# EAGLE design breakout_MDBT40 (EAGLE 7.4.0)
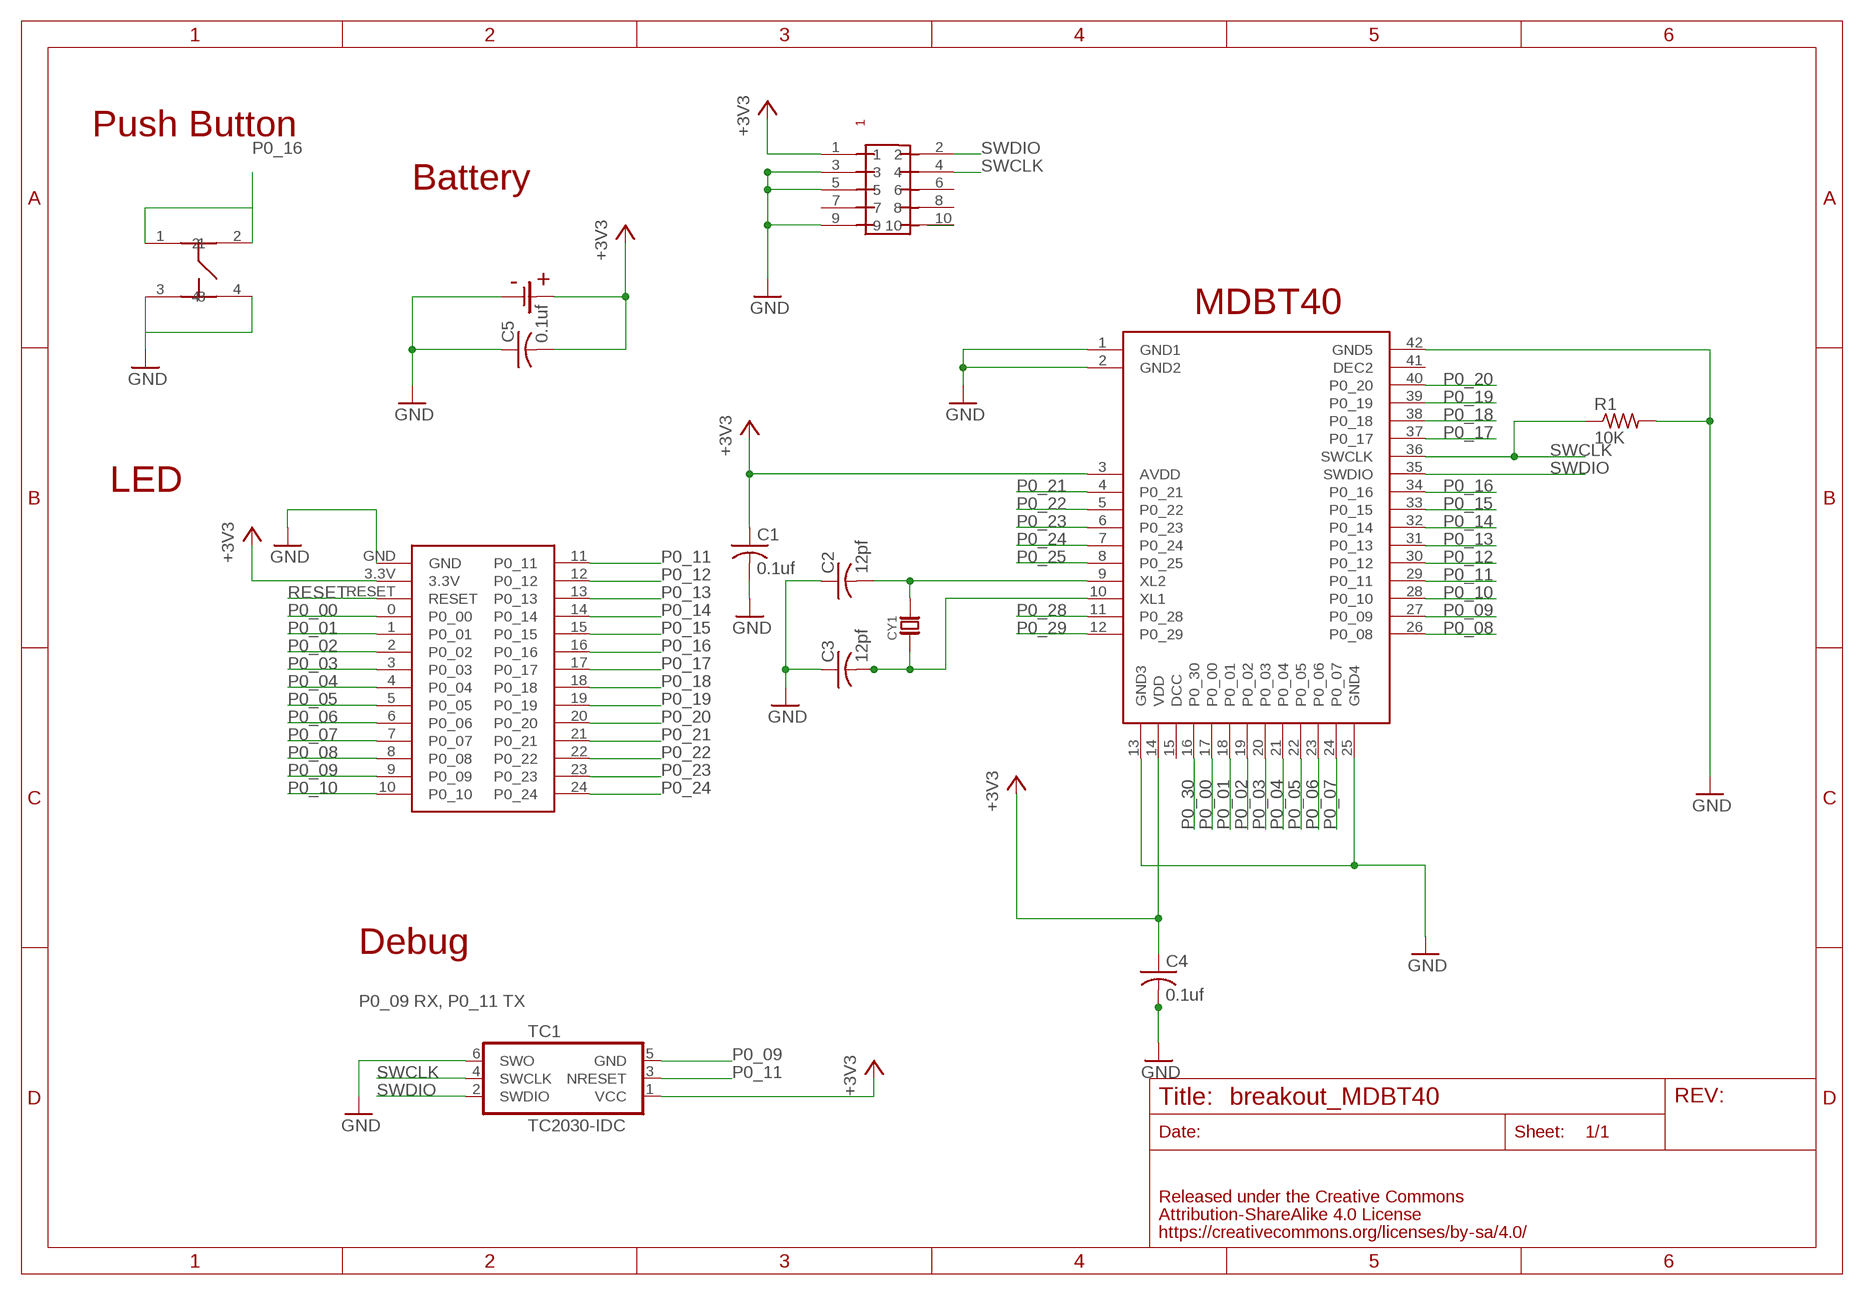
[diagram p0: schematic, sheet 1]

## Parts
C1  0.1uf  C-USC0603  [C0603]
C2  12pf  C-USC0603  [C0603]
C3  12pf  C-USC0603  [C0603]
C4  0.1uf  C-USC0603  [C0603]
C5  0.1uf  C-USC0603  [C0603]
CY1  CRYSTALABS07  [ABRACOM-ABS07-32.768KHZ]
R1  10K  R-US_R0603  [R0603]
TC1  TC2030-IDC  [TC2030-IDC]
U$1  RAYTAC-MDBT40  [RAYTAC-MDBT40]
U$3  BLE-BREAKOUT-NORDIC  [BLE-BREAKOUT-NORDIC]
U$4  PIN-HEADER-SMT(1.27MM)2X5  [PIN-HEADER-SMT(1.27MM)2X5]
U$5  SWICTH-4P(KMR2)  [SWITCH-4P(KMR2)]
U$8  SMTU-TOP2032  [SMTU-2032]

## Nets
+3V3: C1.1 C4.1 C5.2 TC1.1(VCC) U$1.3(AVDD) U$1.14(VDD) U$3.3.3V U$4.1 U$8.+
GND: C1.2 C2.1 C3.1 C4.2 C5.1 R1.2 TC1.6(SWO) U$1.1(GND1) U$1.2(GND2) U$1.13(GND3) U$1.25(GND4) U$1.42(GND5) U$3.GND U$4.3 U$4.5 U$4.9 U$5.3 U$5.4 U$8.-
N$7: C2.2 CY1.P$2 U$1.9(XL2)
N$8: C3.2 CY1.P$1 U$1.10(XL1)
P0_00: U$1.17(P0_00) U$3.0(P0_00)
P0_01: U$1.18(P0_01) U$3.1(P0_01)
P0_02: U$1.19(P0_02) U$3.2(P0_02)
P0_03: U$1.20(P0_03) U$3.3(P0_03)
P0_04: U$1.21(P0_04) U$3.4(P0_04)
P0_05: U$1.22(P0_05) U$3.5(P0_05)
P0_06: U$1.23(P0_06) U$3.6(P0_06)
P0_07: U$1.24(P0_07) U$3.7(P0_07)
P0_08: U$1.26(P0_08) U$3.8(P0_08)
P0_09: TC1.5(GND) U$1.27(P0_09) U$3.9(P0_09)
P0_10: U$1.28(P0_10) U$3.10(P0_10)
P0_11: TC1.3(NRESET) U$1.29(P0_11) U$3.11(P0_11)
P0_12: U$1.30(P0_12) U$3.12(P0_12)
P0_13: U$1.31(P0_13) U$3.13(P0_13)
P0_14: U$1.32(P0_14) U$3.14(P0_14)
P0_15: U$1.33(P0_15) U$3.15(P0_15)
P0_16: U$1.34(P0_16) U$3.16(P0_16) U$5.1 U$5.2
P0_17: U$1.37(P0_17) U$3.17(P0_17)
P0_18: U$1.38(P0_18) U$3.18(P0_18)
P0_19: U$1.39(P0_19) U$3.19(P0_19)
P0_20: U$1.40(P0_20) U$3.20(P0_20)
P0_21: U$1.4(P0_21) U$3.21(P0_21)
P0_22: U$1.5(P0_22) U$3.22(P0_22)
P0_23: U$1.6(P0_23) U$3.23(P0_23)
P0_24: U$1.7(P0_24) U$3.24(P0_24)
P0_25: U$1.8(P0_25)
P0_28: U$1.11(P0_28)
P0_29: U$1.12(P0_29)
P0_30: U$1.16(P0_30)
RESET: U$3.RESET
RESET1: U$4.10
SWCLK: R1.1 TC1.4(SWCLK) U$1.36(SWCLK) U$4.4
SWDIO: TC1.2(SWDIO) U$1.35(SWDIO) U$4.2
Unconnected: U$1.15(DCC) U$1.41(DEC2) U$4.6 U$4.7 U$4.8

## Notes on the sheet
- Push Button
- Battery
- MDBT40
- LED
- Debug
- P0_09 RX, P0_11 TX

## Library data of the parts
C1-C5 = adafruit:C-US: CAPACITOR, American symbol
CY1 = FaBo-Crystal:CRYSTAL
R1 = adafruit:R-US_: RESISTOR, American symbol
TC1 = TagConnect:TC2030-IDC: Tag-Connect In Circuit Programming & Debug Cable 6 Pin http://www.tag-connect.com
U$1 = gclueBT:RAYTAC-MDBT40
U$3 = FaBo-Template:BLE-BREAKOUT-NORDIC
U$4 = gclue:PIN-HEADER-SMT(1.27MM)2X5: PIN-HEADER-SMT (1.27MM) 2x5
U$5 = gclue-test:SWICTH-4P(KMR2)
U$8 = FaBo-Supply:SMTU-TOP

## Board
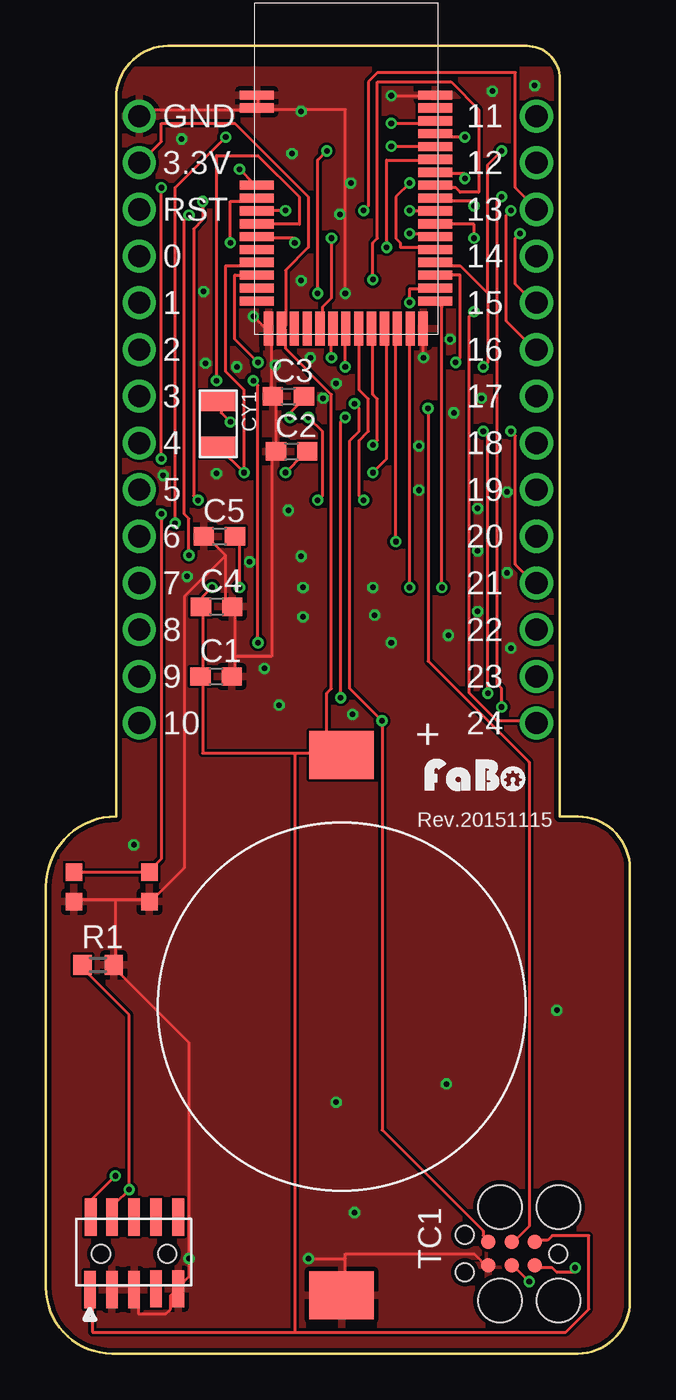
[diagram p1: board, top side]
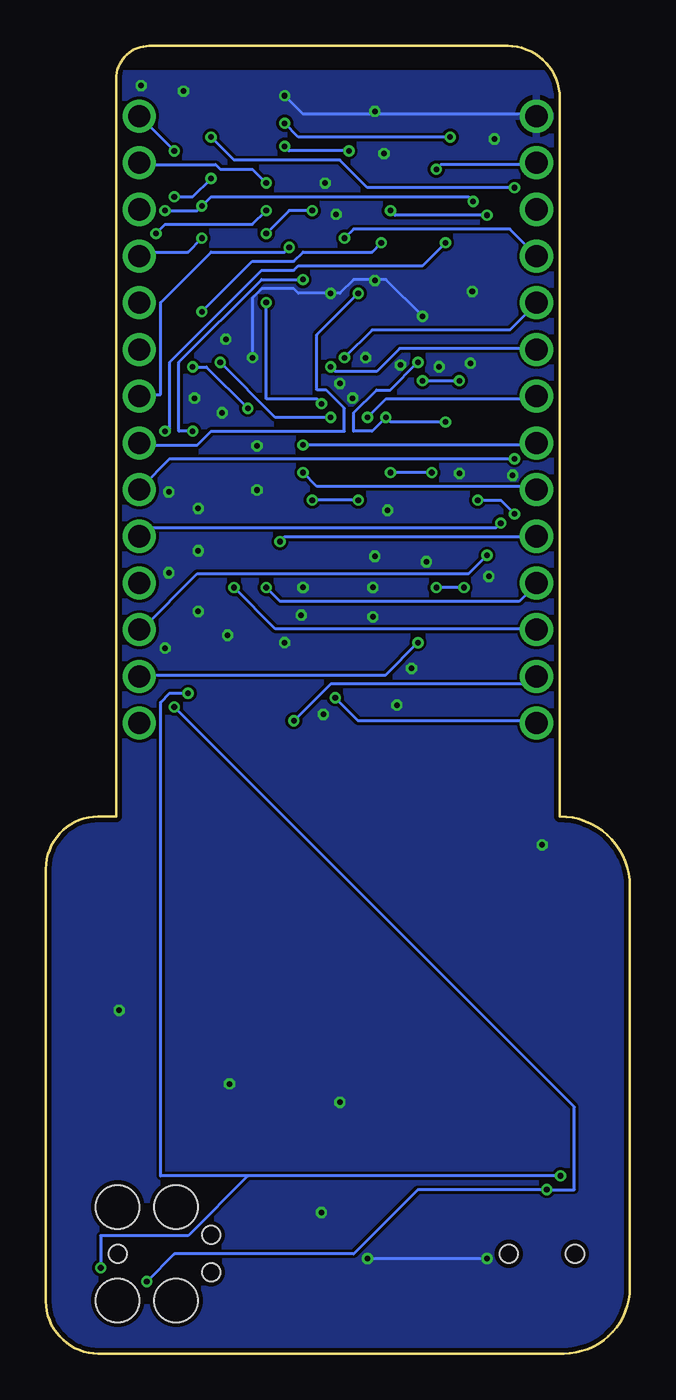
[diagram p2: board, bottom side, seen from below]

Size 31.75 x 71.12 mm. Coordinates in mm from the lower left corner, seen from the top.
Copper layers (1*16): Top 0.035mm / dielectric 1.5mm / Bottom 0.035mm
Design rules "SeeedStudio_2layer_DRU_no_angle_20140221": minimum track width 6mil, minimum drill 12mil, track to track 6mil, track to pad 6mil, pad to pad 6mil, via to via 6mil, smd to smd 0mil, copper to edge 10mil, drill to drill 10mil, minimum pad ring 10mil, minimum via ring 6mil, stop-mask expansion 2mil, vias tented up to drill 100mil, thermal gap 10mil
tRestrict: area -2.3,70 to 33.1,74.7
bRestrict: area -2.7,69.8 to 32.9,74.3

### Footprints (pad centres in the part's own frame; a part is rotated, then mirrored left to right if it is on the bottom)
C0603 = smd 1.1 x 1: 1 -0.85,0; 2 0.85,0
ABRACOM-ABS07-32.768KHZ = smd 1.1 x 1.9: P$1 -1.25,0; P$2 1.25,0
R0603 = smd 1 x 1.1: 1 -0.85,0; 2 0.85,0
TC2030-IDC = smd 0.787 x 0.787: 1 -1.27,-0.635; 2 -1.27,0.635; 3 0,-0.635; 4 0,0.635; 5 1.27,-0.635; 6 1.27,0.635 | hole 0.991: -2.54,0; 2.54,1.016; 2.54,-1.016 | hole 2.375: -2.54,2.54; -2.54,-2.54; 0.635,2.54; 0.635,-2.54
RAYTAC-MDBT40 = smd 1.85 x 0.5: 1 -4.86,4; 2 -4.86,3.3; 3 -4.86,-0.9; 4 -4.86,-1.6; 5 -4.86,-2.3; 6 -4.86,-3; 7 -4.86,-3.7; 8 -4.86,-4.4; 9 -4.86,-5.1; 10 -4.86,-5.8; 11 -4.86,-6.5; 12 -4.86,-7.2; 26 4.84,-7.2; 27 4.84,-6.5; 28 4.84,-5.8; 29 4.84,-5.1; 30 4.84,-4.4; 31 4.84,-3.7; 32 4.84,-3; 33 4.84,-2.3; 34 4.84,-1.6; 35 4.84,-0.9; 36 4.84,-0.2; 37 4.84,0.5; 38 4.84,1.2; 39 4.84,1.9; 40 4.84,2.6; 41 4.84,3.3; 42 4.84,4 | smd 0.5 x 1.85: 13 -4.22,-8.71; 14 -3.52,-8.71; 15 -2.82,-8.71; 16 -2.12,-8.71; 17 -1.42,-8.71; 18 -0.72,-8.71; 19 -0.02,-8.71; 20 0.68,-8.71; 21 1.38,-8.71; 22 2.08,-8.71; 23 2.78,-8.71; 24 3.48,-8.71; 25 4.18,-8.71
BLE-BREAKOUT-NORDIC = drill 1.2: 0 -11.43,25.4; 1 -11.43,22.86; 2 -11.43,20.32; 3 -11.43,17.78; 3.3V -11.43,30.48; 4 -11.43,15.24; 5 -11.43,12.7; 6 -11.43,10.16; 7 -11.43,7.62; 8 -11.43,5.08; 9 -11.43,2.54; 10 -11.43,0; 11 10.16,33.02; 12 10.16,30.48; 13 10.16,27.94; 14 10.16,25.4; 15 10.16,22.86; 16 10.16,20.32; 17 10.16,17.78; 18 10.16,15.24; 19 10.16,12.7; 20 10.16,10.16; 21 10.16,7.62; 22 10.16,5.08; 23 10.16,2.54; 24 10.16,0; GND -11.43,33.02; RESET -11.43,27.94
PIN-HEADER-SMT(1.27MM)2X5 = smd 0.635 x 2.032: 1 -2.4,-1.95; 2 -2.35,2; 3 -1.2,-1.95; 4 -1.2,2; 5 0,-1.95; 6 0,2; 7 1.2,-1.9; 8 1.2,2; 9 2.4,-1.9; 10 2.4,2 | hole 1: 1.8,0; -1.8,0
SWITCH-4P(KMR2) = smd 0.9 x 0.95: 1 -1,0; 2 3.1,0; 3 -1,-1.6; 4 3.1,-1.6
SMTU-2032 = smd 3.5 x 2.6: + 0,13.7; - 0,-15.7

### Placement (x,y rotation side)
C1  9.25,36.82 0 top
C2  13.35,49.06 0 top
C3  13.17,52.06 0 top
C4  9.27,40.62 0 top
C5  9.43,44.45 0 top
CY1  9.37,50.56 270 top
R1  2.83,21.14 0 top
TC1  25.31,5.43 180 top
U$1  16.32,64.45 0 top
U$3  16.51,34.29 0 top
U$4  4.79,5.42 0 top
U$5  2.52,26.18 0 top
U$7  [LOGO_FABO_S]  23.38,30.59 0 top
U$8  16.07,18.86 0 top

### Tracks (layer width: path | path; a pad name or v marks a point on that pad's centre or on a via)
+3V3  (via drill 0.3)
  Top 0.152: 13.52,1.16 2.52,1.16 2.52,3.41 U$4.1 | 13.52,1.16 28.27,1.16 29.52,2.41 29.52,6.41 27.52,6.41 27.27,6.16 26.77,6.16 TC1.1 | U$3.3.3V 5.27,64.91 6.27,65.91 6.27,66.91 10.27,66.91 14.27,62.91 14.27,60.16 13.02,58.91 13.02,55.91 U$1.14 13.02,55.66 13.02,54.66 15.52,52.16 15.52,36.16 15.27,35.91 15.27,32.66 | v10.52,64.41 11.27,63.66 U$1.3 | v10.52,41.66 10.52,44.41 C5.2 | v9.02,41.66 8.52,41.16 8.52,40.66 C4.1 8.52,40.41 8.52,36.91 C1.1 8.52,36.66 8.52,32.66 13.52,32.66 | 13.52,32.66 15.27,32.66 | 15.27,32.66 16.02,32.66 U$8.+ 15.27,32.66 | 13.52,32.66 13.52,1.16
  Bottom 0.152: v10.52,64.41 10.27,64.66 5.27,64.66 U$3.3.3V | v9.02,41.66 v10.52,41.66
GND  (via drill 0.3)
  Top 0.152: 16.27,5.16 16.27,3.16 U$8.- | 16.27,5.16 16.27,5.41 23.27,5.41 24.02,4.66 TC1.6 | U$4.3 3.77,3.66 4.77,3.66 U$4.5 5.02,3.41 5.02,2.16 6.52,2.16 6.77,2.41 6.77,3.16 7.02,3.41 U$4.9 7.27,3.66 7.77,4.16 v7.77,5.16 7.77,16.91 3.77,20.91 R1.2 3.77,21.16 3.77,24.66 | 3.77,24.66 5.52,24.66 U$5.4 5.77,24.66 7.52,26.41 7.52,41.16 9.77,43.41 | 3.77,24.66 1.52,24.66 U$5.3 | v14.27,5.16 16.27,5.16 | U$1.2 11.52,67.91 11.52,68.41 U$1.1 | v18.77,68.41 21.02,68.41 U$1.42 | U$1.2 11.27,67.66 5.27,67.66 5.27,67.41 U$3.GND | 10.27,37.91 10.27,40.41 C4.2 10.02,40.66 9.77,40.91 9.77,43.41 | 10.27,37.91 10.27,36.91 C1.2 | 9.77,43.41 8.77,44.41 C5.1 | v20.52,54.16 20.52,55.66 U$1.25 | v11.27,56.41 12.02,55.66 U$1.13 12.27,55.66 12.27,52.16 C3.1 12.52,51.91 12.52,49.16 C2.1 12.27,48.91 12.27,37.91 10.27,37.91 | v16.27,57.66 16.27,67.66 11.52,67.66 U$1.2
  Bottom 0.152: v7.77,5.16 v14.27,5.16 | v18.77,68.41 17.77,67.41 5.27,67.41 U$3.GND | v20.52,54.16 20.52,57.41 20.02,57.91 18.27,57.91 18.02,57.66 v16.27,57.66 15.77,57.66 15.02,58.41 13.27,58.41 v11.27,56.41
  other vias: 15.77,13.66 16.77,7.66 21.77,14.66 27.77,18.66 4.77,27.66 18.77,38.66 17.87,40.16 17.77,41.66 13.97,41.66 13.97,40.06 13.87,43.36 13.17,45.86 21.87,39.06 22.17,51.16 9.27,47.86 8.57,57.76 13.87,58.36 21.97,55.16 7.37,66.06 13.37,65.26 13.87,67.56 24.27,68.66 26.57,68.96 20.27,49.36 20.27,46.96 15.97,61.96 16.57,63.66 12.67,35.26 11.87,37.26 7.67,42.26 8.67,53.86 10.37,53.66 12.47,53.76 15.77,52.76 15.07,51.96 14.37,54.16 16.67,34.76 25.27,38.36 25.07,42.46 25.07,46.86 23.47,45.96 23.47,43.66 23.47,40.36 23.67,51.96 6.37,47.76 11.07,43.06
  pour Top: -0.23,-0.34 31.77,-0.34 31.77,71.66 -0.23,71.66
  pour Bottom: -0.23,-0.34 31.77,-0.34 31.77,71.66 -0.23,71.66
N$7  (via drill 0.3)
  Top 0.152: v13.02,47.91 14.02,48.91 C2.2 | CY1.P$2 v10.77,47.91 10.77,52.41 9.77,53.41 9.77,59.16 11.27,59.16 U$1.9
  Bottom 0.152: v10.77,47.91 v13.02,47.91
N$8  (via drill 0.3)
  Top 0.152: v13.27,50.91 13.27,51.16 14.02,51.91 C3.2 | v10.02,50.66 9.52,51.16 9.52,51.66 CY1.P$1 | v11.52,53.91 10.27,55.16 10.27,58.66 11.27,58.66 U$1.10
  Bottom 0.152: v10.02,50.66 13.02,50.66 v13.27,50.91 14.02,50.16 15.02,50.16 15.02,51.16 13.77,52.41 13.02,52.41 v11.52,53.91
P0_00  (via drill 0.3)
  Top 0.152: v15.52,60.66 15.52,57.41 15.02,56.91 15.02,55.91 U$1.17
  Bottom 0.152: v15.52,60.66 15.02,61.16 6.52,61.16 5.27,59.91 U$3.0
P0_01  (via drill 0.3)
  Top 0.152: v15.52,54.16 15.52,55.66 U$1.18
  Bottom 0.152: v15.52,54.16 14.02,55.66 6.52,55.66 5.27,56.91 U$3.1
P0_02  (via drill 0.3)
  Top 0.152: v16.27,53.66 16.27,55.66 U$1.19
  Bottom 0.152: v16.27,53.66 16.02,53.41 13.77,53.41 12.52,54.66 5.27,54.66 U$3.2
P0_03  (via drill 0.3)
  Top 0.152: v17.27,46.41 17.02,46.66 17.02,49.66 17.52,50.16 17.52,51.91 17.02,52.41 17.02,55.66 U$1.20 | v14.77,46.41 15.02,46.66 15.02,50.16 v14.27,50.91
  Bottom 0.152: v14.77,46.41 v17.27,46.41 | v14.27,50.91 13.27,51.91 5.27,51.91 U$3.3
P0_04  (via drill 0.3)
  Top 0.152: v17.77,49.41 18.02,49.66 18.02,51.91 17.77,52.16 17.77,55.66 U$1.21
  Bottom 0.152: v17.77,49.41 5.27,49.41 U$3.4
P0_05  (via drill 0.3)
  Top 0.152: v17.77,47.91 18.52,48.66 18.52,55.66 U$1.22
  Bottom 0.152: v17.77,47.91 17.02,47.16 5.27,47.16 U$3.5
P0_06  (via drill 0.3)
  Top 0.152: v19.02,44.16 19.02,55.66 U$1.23
  Bottom 0.152: v19.02,44.16 18.77,44.41 5.27,44.41 U$3.6
P0_07  (via drill 0.3)
  Top 0.152: v19.77,41.66 19.77,55.66 U$1.24
  Bottom 0.152: v19.77,41.66 19.02,40.91 6.02,40.91 5.27,41.66 U$3.7
P0_08  (via drill 0.3)
  Top 0.152: v21.52,41.66 21.52,56.91 21.27,57.16 U$1.26
  Bottom 0.152: v21.52,41.66 19.27,39.41 5.27,39.41 U$3.8
P0_09  (via drill 0.3)
  Top 0.152: TC1.5 24.02,6.16 23.77,6.41 23.77,6.66 18.27,12.16 v18.27,34.41 16.52,36.16 16.52,49.66 17.02,50.16 17.02,51.41 v16.77,51.66 | v19.77,57.16 19.77,57.91 21.02,57.91 U$1.27
  Bottom 0.152: v18.27,34.41 16.27,36.41 5.52,36.41 5.27,36.66 U$3.9 | v19.77,57.16 19.77,51.91 17.02,51.91 v16.77,51.66
P0_10  (via drill 0.3)
  Top 0.152: v22.27,53.91 22.52,54.16 22.52,58.66 21.27,58.66 U$1.28 | v16.27,50.91 16.02,50.66 v16.02,35.66
  Bottom 0.152: v22.27,53.91 19.27,50.91 v16.27,50.91 | v16.02,35.66 14.77,34.41 5.27,34.41 U$3.10
P0_11  (via drill 0.3)
  Top 0.152: v20.77,51.41 20.77,37.66 26.27,32.16 26.27,6.91 25.52,6.16 TC1.3 | v23.77,53.66 24.02,53.91 24.02,57.66 | 24.02,57.66 22.52,59.16 21.27,59.16 U$1.29 | v24.77,65.41 24.02,64.66 24.02,57.66
  Bottom 0.152: v20.77,51.41 23.02,53.66 v23.77,53.66 | v24.77,65.41 26.52,67.16 U$3.11
P0_12  (via drill 0.3)
  Top 0.152: v19.77,63.66 19.02,62.91 19.02,60.66 19.27,60.41 19.27,60.16 21.02,60.16 U$1.30
  Bottom 0.152: v19.77,63.66 20.52,64.41 22.27,64.41 22.52,64.66 26.52,64.66 U$3.12
P0_13  (via drill 0.3)
  Top 0.152: v19.77,60.91 21.02,60.91 U$1.31 | v17.27,62.16 17.52,62.41 17.52,69.16 18.02,69.66 25.52,69.66 25.52,63.41 26.52,62.41 U$3.13
  Bottom 0.152: v19.77,60.91 18.52,62.16 v17.27,62.16
P0_14  (via drill 0.3)
  Top 0.152: v23.27,60.66 23.27,61.41 21.27,61.41 U$1.32
  Bottom 0.152: v23.27,60.66 24.02,59.91 26.52,59.91 U$3.14
P0_15  (via drill 0.3)
  Top 0.152: v19.77,62.16 21.02,62.16 U$1.33 | v25.77,60.91 25.52,60.66 25.52,58.16 26.52,57.16 U$3.15
  Bottom 0.152: v19.77,62.16 20.52,61.41 25.27,61.41 v25.77,60.91
P0_16  (via drill 0.3)
  Top 0.152: U$5.1 1.52,26.16 5.52,26.16 U$5.2 5.77,26.41 6.27,26.91 v6.27,45.66 | v23.27,62.41 23.27,62.66 21.27,62.66 U$1.34 | v25.27,62.16 25.02,61.91 25.02,56.16 26.52,54.66 U$3.16 | v8.27,46.41 8.02,46.66 8.02,61.16 8.52,61.66 v8.52,62.66
  Bottom 0.152: v25.27,62.16 23.52,62.16 v23.27,62.41 22.77,62.91 8.77,62.91 v8.52,62.66 | v6.27,45.66 7.02,46.41 v8.27,46.41
P0_17  (via drill 0.3)
  Top 0.152: v18.52,60.16 18.52,64.91 21.02,64.91 U$1.37
  Bottom 0.152: v18.52,60.16 18.77,59.91 22.77,59.91 25.52,57.16 25.52,52.16 26.52,52.16 U$3.17
P0_18  (via drill 0.3)
  Top 0.152: v18.77,65.66 21.02,65.66 U$1.38 | v15.27,65.41 14.77,64.91 v14.77,57.66
  Bottom 0.152: v18.77,65.66 18.52,65.41 v15.27,65.41 | v14.77,57.66 17.02,55.41 17.02,52.41 16.52,52.41 15.52,51.41 15.52,50.16 22.77,50.16 23.52,49.41 26.52,49.41 U$3.18
P0_19  (via drill 0.3)
  Top 0.152: v22.77,66.16 21.27,66.16 U$1.39 | v6.27,48.66 v6.27,63.41
  Bottom 0.152: v22.77,66.16 21.52,64.91 15.77,64.91 14.27,63.41 v6.27,63.41 | v6.27,48.66 25.02,48.66 26.52,47.16 U$3.19
P0_20  (via drill 0.3)
  Top 0.152: v18.77,66.91 21.02,66.91 U$1.40 | v9.77,66.16 7.02,63.41 v7.02,45.16
  Bottom 0.152: v18.77,66.91 18.02,66.16 v9.77,66.16 | v7.02,45.16 7.27,44.91 26.27,44.91 26.52,44.66 U$3.20
P0_21  (via drill 0.3)
  Top 0.152: v10.02,60.41 10.02,62.66 11.27,62.66 U$1.4 | v25.27,50.16 25.52,49.91 25.52,42.91 26.52,41.91 U$3.21
  Bottom 0.152: v10.02,60.41 11.27,59.16 18.02,59.16 18.27,58.91 20.02,58.91 25.02,53.91 25.02,50.16 v25.27,50.16
P0_22  (via drill 0.3)
  Top 0.152: v13.02,62.16 11.52,62.16 U$1.5 | v7.77,61.91 7.52,61.66 7.52,45.66 7.77,45.41 v7.77,43.41
  Bottom 0.152: v13.02,62.16 12.77,61.91 v7.77,61.91 | v7.77,43.41 8.77,42.41 23.52,42.41 26.52,39.41 U$3.22
P0_23  (via drill 0.3)
  Top 0.152: v9.27,52.91 9.27,65.16 11.52,65.16 13.77,62.91 13.77,61.41 11.52,61.41 U$1.6 | v11.27,52.91 11.52,52.66 v11.52,38.66
  Bottom 0.152: v11.27,52.91 v9.27,52.91 | v11.52,38.66 13.27,36.91 26.52,36.91 U$3.23
P0_24  (via drill 0.3)
  Top 0.152: v13.52,60.41 13.52,60.66 11.52,60.66 U$1.7 | v23.27,56.66 23.02,56.41 23.02,35.91 24.52,34.41 26.52,34.41 U$3.24
  Bottom 0.152: v13.52,60.41 14.02,59.91 17.77,59.91 18.27,59.41 20.52,59.41 v23.27,56.66
SWCLK  (via drill 0.3)
  Top 0.152: v26.27,3.91 25.52,4.66 TC1.4 | U$4.4 3.77,7.66 3.77,8.16 v4.52,8.91 4.52,18.41 2.02,20.91 R1.1 | v22.77,63.91 22.77,64.16 21.27,64.16 U$1.36 | v24.77,62.91 24.52,62.66 24.52,36.41 24.77,36.16 v24.77,35.16
  Bottom 0.152: v26.27,3.91 24.77,5.41 15.02,5.41 11.52,8.91 v4.52,8.91 3.02,8.91 3.02,13.41 v24.77,35.16 | v22.77,63.91 23.77,62.91 v24.77,62.91
SWDIO  (via drill 0.3)
  Top 0.152: v28.77,4.66 28.77,4.41 27.77,4.41 27.52,4.66 26.77,4.66 TC1.2 | v3.77,9.66 2.52,8.41 2.52,7.66 U$4.2 | v17.77,58.41 17.77,60.41 18.02,60.66 18.02,69.16 22.02,69.16 23.52,67.66 23.52,63.16 22.52,63.16 22.27,63.41 21.27,63.41 U$1.35 | v23.77,50.16 24.02,49.91 v24.02,35.91
  Bottom 0.152: v28.77,4.66 28.77,6.41 24.02,6.41 20.77,9.66 | v3.77,9.66 20.77,9.66 | v17.77,58.41 20.02,58.41 24.52,53.91 24.52,50.16 v23.77,50.16 | v24.02,35.91 25.02,35.91 25.52,35.41 25.52,9.66 20.77,9.66

### Text on the board
tPlace: Rev.20151115